# EAGLE design fp2ov2 (EAGLE 5.06)
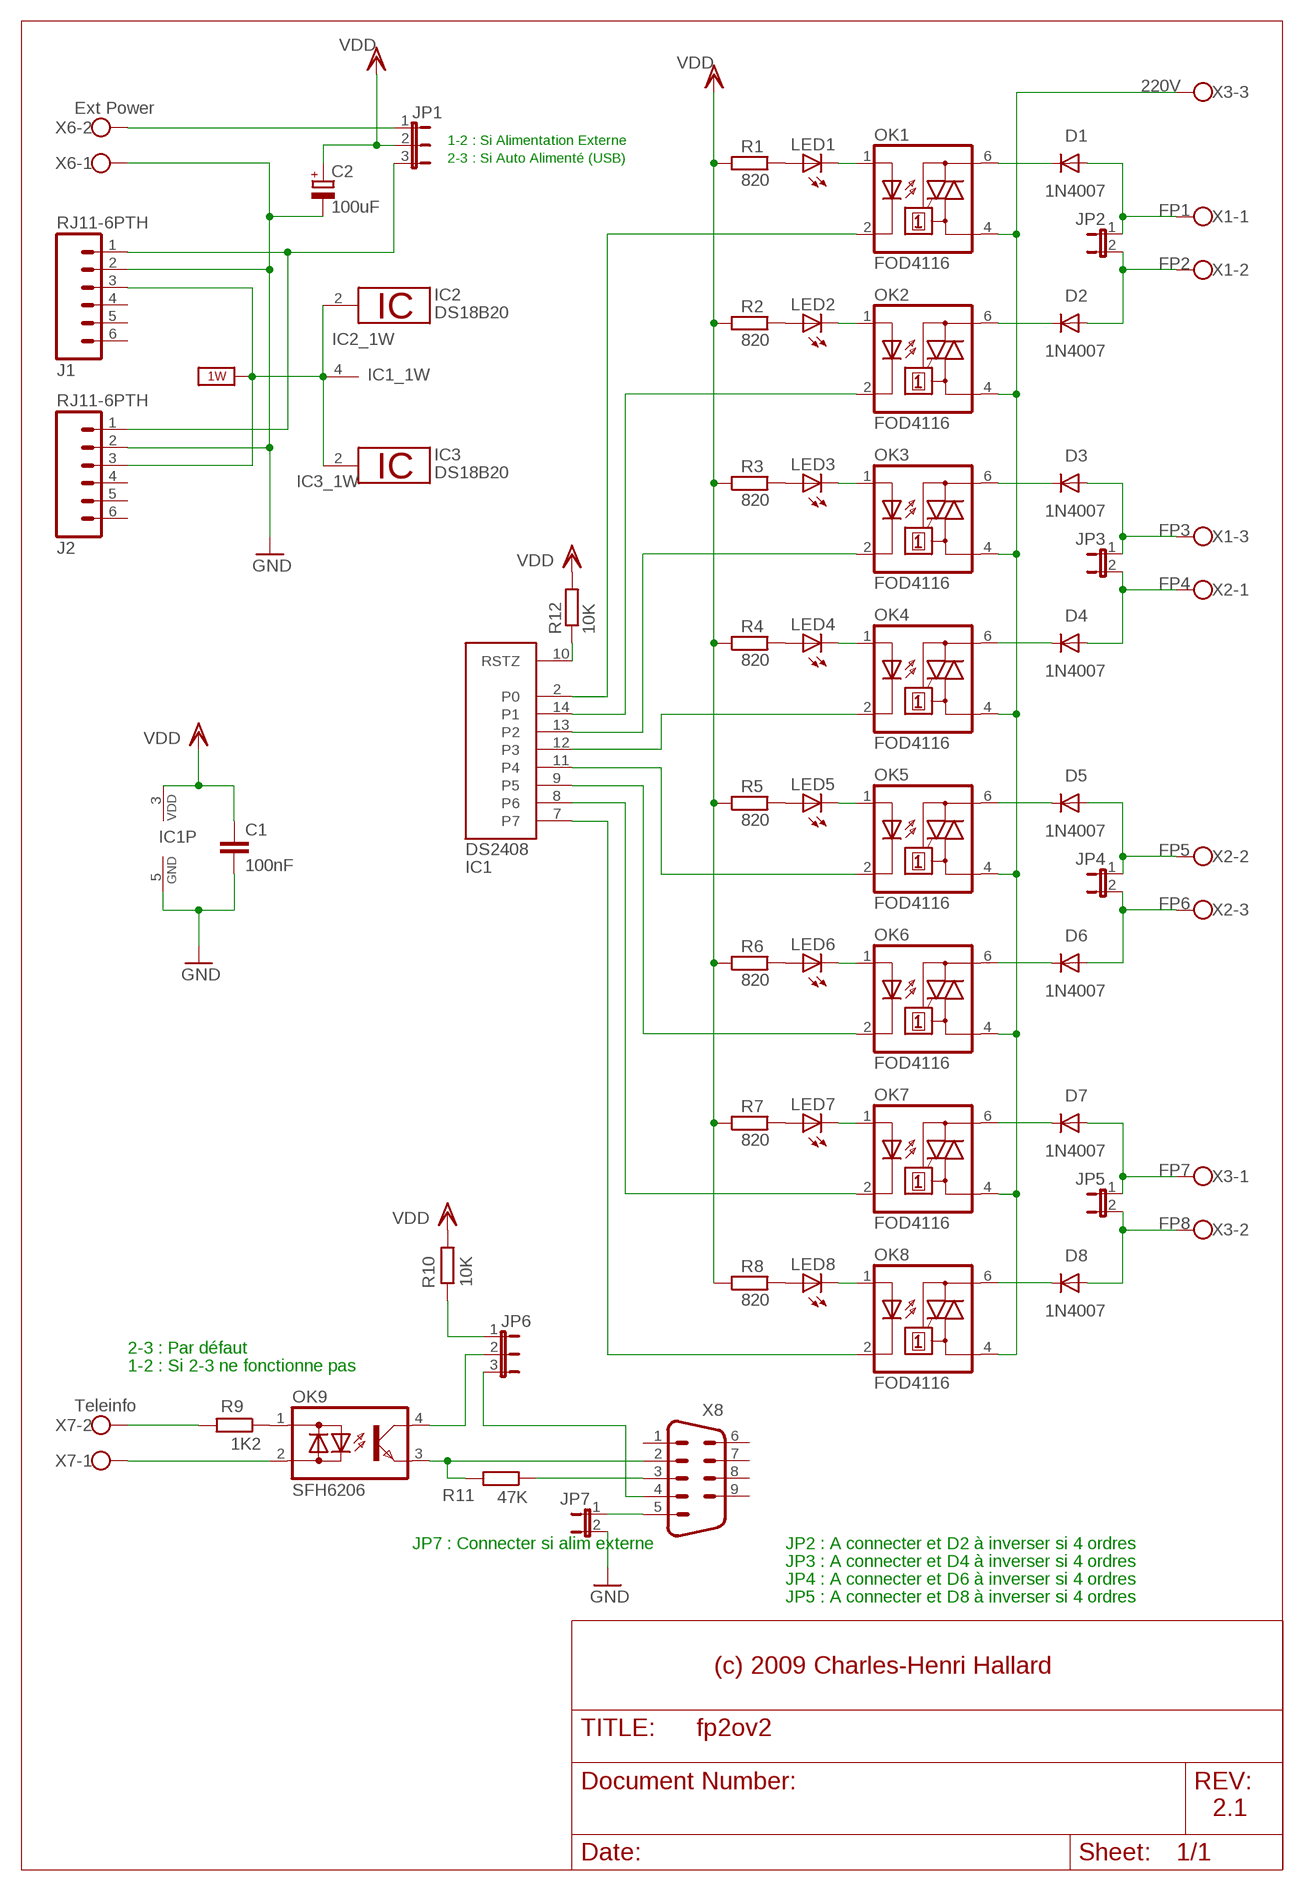
[diagram p0: schematic, sheet 1]

## Parts
C1  100nF  C-EU050-024X044  [C050-024X044]
C2  100uF  CPOL-EUE2,5-6E  [E2,5-6E]
D1  1N4007  1N4004  [DO41-10]
D2  1N4007  1N4004  [DO41-10]
D3  1N4007  1N4004  [DO41-10]
D4  1N4007  1N4004  [DO41-10]
D5  1N4007  1N4004  [DO41-10]
D6  1N4007  1N4004  [DO41-10]
D7  1N4007  1N4004  [DO41-10]
D8  1N4007  1N4004  [DO41-10]
IC1  DS2408  [SOIC-DIL16]
IC2  DS18B20  [TO92-]
IC3  DS18B20  [TO92-]
J1  RJ11-6PTH  [RJ11-6]
J2  RJ11-6PTH  [RJ11-6]
JP1  JP2E  [JP2]
JP2  JP1E  [JP1]
JP3  JP1E  [JP1]
JP4  JP1E  [JP1]
JP5  JP1E  [JP1]
JP6  JP2E  [JP2]
JP7  JP1E  [JP1]
LED1  LED3MM  [LED3MM]
LED2  LED3MM  [LED3MM]
LED3  LED3MM  [LED3MM]
LED4  LED3MM  [LED3MM]
LED5  LED3MM  [LED3MM]
LED6  LED3MM  [LED3MM]
LED7  LED3MM  [LED3MM]
LED8  LED3MM  [LED3MM]
OK1  FOD4116  [DIL06]
OK2  FOD4116  [DIL06]
OK3  FOD4116  [DIL06]
OK4  FOD4116  [DIL06]
OK5  FOD4116  [DIL06]
OK6  FOD4116  [DIL06]
OK7  FOD4116  [DIL06]
OK8  FOD4116  [DIL06]
OK9  SFH6206  SFH620A  [DIL04]
R1  820  R-EU_0207/10  [0207/10]
R2  820  R-EU_0207/10  [0207/10]
R3  820  R-EU_0207/10  [0207/10]
R4  820  R-EU_0207/10  [0207/10]
R5  820  R-EU_0207/10  [0207/10]
R6  820  R-EU_0207/10  [0207/10]
R7  820  R-EU_0207/10  [0207/10]
R8  820  R-EU_0207/10  [0207/10]
R9  1K2  R-EU_0207/10  [0207/10]
R10  10K  R-EU_0207/10  [0207/10]
R11  47K  R-EU_0207/10  [0207/10]
R12  10K  R-EU_0207/12  [0207/12]
X1  CON-CLAMP-3  [W237-103]
X2  CON-CLAMP-3  [W237-103]
X3  CON-CLAMP-3  [W237-103]
X6  Ext Power  W237-102  [W237-102]
X7  Teleinfo  W237-102  [W237-102]
X8  M09HP  [M09HP]

## Nets
1W: IC1.4(1W) IC2.2 IC3.2 J1.3 J2.3 ; supply symbol labelled 1W_SUP
220V [220]: OK1.4(A1) OK2.4(A1) OK3.4(A1) OK4.4(A1) OK5.4(A1) OK6.4(A1) OK7.4(A1) OK8.4(A1) X3.3
FP1 [220]: D1.A JP2.1 X1.1
FP2 [220]: D2.A JP2.2 X1.2
FP3 [220]: D3.A JP3.1 X1.3
FP4 [220]: D4.A JP3.2 X2.1
FP5 [220]: D5.A JP4.1 X2.2
FP6 [220]: D6.A JP4.2 X2.3
FP7 [220]: D7.A JP5.1 X3.1
FP8 [220]: D8.A JP5.2 X3.2
GND [Power]: C1.2 C2.- IC1.5(GND) J1.2 J2.2 JP7.2 X6.1
N$1: LED1.K(C) OK1.1(A)
N$2: LED2.K(C) OK2.1(A)
N$3: LED1.A R1.2
N$4: LED2.A R2.2
N$5: IC1.14(P1) OK2.2(C)
N$6: OK9.1(AC1) R9.1
N$7 [220]: D1.C OK1.6(A2)
N$8 [220]: D2.C OK2.6(A2)
N$9 [220]: D3.C OK3.6(A2)
N$10: OK9.2(AC2) X7.1
N$11: LED3.K(C) OK3.1(A)
N$12: IC1.13(P2) OK3.2(C)
N$13: LED4.K(C) OK4.1(A)
N$14: IC1.12(P3) OK4.2(C)
N$15: IC1.11(P4) OK5.2(C)
N$16: IC1.9(P5) OK6.2(C)
N$17: IC1.8(P6) OK7.2(C)
N$18 [220]: D4.C OK4.6(A2)
N$19: LED3.A R3.2
N$20 [220]: D6.C OK6.6(A2)
N$21: IC1.7 OK8.2(C)
N$22: LED4.A R4.2
N$23: LED5.K(C) OK5.1(A)
N$24: LED6.K(C) OK6.1(A)
N$25: LED6.A R6.2
N$26: LED7.A R7.2
N$27: LED8.A R8.2
N$28: LED5.A R5.2
N$29: IC1.2(P0) OK1.2(C)
N$30 [220]: D5.C OK5.6(A2)
N$31: JP6.1 R10.2
N$32: OK9.3(E) R11.2 X8.2
N$33: LED7.K(C) OK7.1(A)
N$34: LED8.K(C) OK8.1(A)
N$35: JP7.1 X8.5
N$36: JP6.2 OK9.4(C)
N$37: R9.2 X7.2
N$39 [220]: D8.C OK8.6(A2)
N$40 [220]: D7.C OK7.6(A2)
N$41: JP6.3 X8.4
N$42: R11.1 X8.3
N$74: IC1.10(RSTZ) R12.1
N$100 [Power]: J1.1 J2.1 JP1.3
N$101 [Power]: JP1.1 X6.2
VDD [Power]: C1.1 C2.+ IC1.3(VDD) JP1.2 R1.1 R2.1 R3.1 R4.1 R5.1 R6.1 R7.1 R8.1 R10.1 R12.2
Unconnected: J1.4 J1.5 J1.6 J2.4 J2.5 J2.6 X8.1 X8.6 X8.7 X8.8 X8.9

## Notes on the sheet
- 1-2 : Si Alimentation Externe
- 2-3 : Si Auto Alimenté (USB)
- 2-3 : Par défaut
- 1-2 : Si 2-3 ne fonctionne pas
- JP7 : Connecter si alim externe | JP2 : A connecter et D2 à inverser si 4 ordres
- JP3 : A connecter et D4 à inverser si 4 ordres
- JP4 : A connecter et D6 à inverser si 4 ordres
- JP5 : A connecter et D8 à inverser si 4 ordres
- (c) 2009 Charles-Henri Hallard
- 2.1

## Power pins joined to a net without a drawn wire
GND: IC2.1 IC3.1
VDD: IC2.3 IC3.3

## Library data of the parts
C1 = resistor:C-EU: CAPACITOR, European symbol
C2 = resistor:CPOL-EU: POLARIZED CAPACITOR, European symbol
D1-D8 = diode:1N4004: DIODE general purpose rectifier, 1 A
IC1 = _c2h:DS2408: 8-Channel Addressable Switch This is a general purpose I/O multiplier. The PIO pins P0..P7 are inputs/open drain outputs and can be used in a mixed I/O fashion. Output sink capability is appr. 4mA. Each input state can be read but changing input signals additionally trigger the egde detector for this input. The edge detector state can be read back, too. The RSTZ pin can be configured by software as a –STROBE output (default) or as the common edge detector –RESET input. In the latter mode, the output pins are all set to floating on a –RESET trigger, too. Author: Jan Kandziora <jjj@gmx.de>
IC2 IC3 = 1wire:DS18B20: Programmable Resolution Digital Thermometer This chip provides a onewire thermosensor with approx. 0.5°C accuracy. A programmable over/undertemperure alarm is available. The precision can be set from 9..12 bits. Notes: Vdd must be applied for accurate measurements at low temperatures, as the parasite power circuit otherwise heats the sensor. If parasite power is used, Vdd has to be connected to GND. The DS1822 is a low-cost thermometer chip, the DS18S20 is similar to the DS18B20, but with 9 Bit precision only. Author: Jan Kandziora <jjj@gmx.de>
J1 J2 = _c2h:RJ11-6: RJ11 Jack Simple 6 pin RJ11 jack. Commonly found on CAT3 devices and Microchip programmers. SKU: PRT-00132
JP1 JP6 = jumper:JP2E: JUMPER
JP2-JP5 JP7 = jumper:JP1E: JUMPER
LED1-LED8 = led:LED: LED OSRAM: - CHIPLED LG R971, LG N971, LY N971, LG Q971, LY Q971, LO R971, LY R971 LH N974, LH R974 LS Q976, LO Q976, LY Q976 LO Q996 - Hyper CHIPLED LW Q18S LB Q993, LB Q99A, LB R99A - SideLED LS A670, LO A670, LY A670, LG A670, LP A670 LB A673, LV A673, LT A673, LW A673 LH A674 LY A675 LS A676, LA A676, LO A676, LY A676, LW A676 LS A679, LY A679, LG A679 - Hyper Micro SIDELED® LS Y876, LA Y876, LO Y876, LY Y876 LT Y87S - SmartLED LW L88C, LW L88S LB L89C, LB L89S, LG L890 LS L89K, LO L89K, LY L89K LS L896, LA L896, LO L896, LY L896 - TOPLED LS T670, LO T670, LY T670, LG T670, LP T670 LSG T670, LSP T670, LSY T670, LOP T670, LYG T670 LG T671, LOG T671, LSG T671 LB T673, LV T673, LT T673, LW T673 LH T674 LS T676, LA T676, LO T676, LY T676, LB T676, LH T676, LSB T676, LW T676 LB T67C, LV T67C, LT T67C, LS T67K, LO T67K, LY T67K, LW E67C LS E67B, LA E67B, LO E67B, LY E67B, LB E67C, LV E67C, LT E67C LW T67C LS T679, LY T679, LG T679 LS T770, LO T770, LY T770, LG T770, LP T770 LB T773, LV T773, LT T773, LW T773 LH T774 LS E675, LA E675, LY E675, LS T675 LS T776, LA T776, LO T776, LY T776, LB T776 LHGB T686 LT T68C, LB T68C - Hyper Mini TOPLED® LB M676 - Mini TOPLED Santana® LG M470 LS M47K, LO M47K, LY M47K Source: http://www.osram.convergy.de LUXEON: - LUMILED® LXK2-PW12-R00, LXK2-PW12-S00, LXK2-PW14-U00, LXK2-PW14-V00 LXK2-PM12-R00, LXK2-PM12-S00, LXK2-PM14-U00 LXK2-PE12-Q00, LXK2-PE12-R00, LXK2-PE12-S00, LXK2-PE14-T00, LXK2-PE14-U00 LXK2-PB12-K00, LXK2-PB12-L00, LXK2-PB12-M00, LXK2-PB14-N00, LXK2-PB14-P00, LXK2-PB14-Q00 LXK2-PR12-L00, LXK2-PR12-M00, LXK2-PR14-Q00, LXK2-PR14-R00 LXK2-PD12-Q00, LXK2-PD12-R00, LXK2-PD12-S00 LXK2-PH12-R00, LXK2-PH12-S00 LXK2-PL12-P00, LXK2-PL12-Q00, LXK2-PL12-R00 Source: www.luxeon.com KINGBRIGHT: KA-3528ASYC Source: www.kingbright.com
OK1-OK8 = _c2h:FOD4116: SIEMENS OPTO COUPLER
OK9 = optocoupler:SFH620: Optocoupler, Phototransistor Output, AC Input Source: http://www.vishay.com/docs/83675/sfh620.pdf
R1-R12 = resistor:R-EU_: RESISTOR, European symbol
X1-X3 = _c2h:CON-CLAMP-3: WAGO SCREW CLAMP
X6 X7 = con-wago-500:W237-102: WAGO SCREW CLAMP
X8 = con-subd:M09: SUB-D

## Net classes
0 default: width 0.3 mm
1 220: width 1 mm, drill 0.203 mm
2 Power: width 0.3 mm

## Board
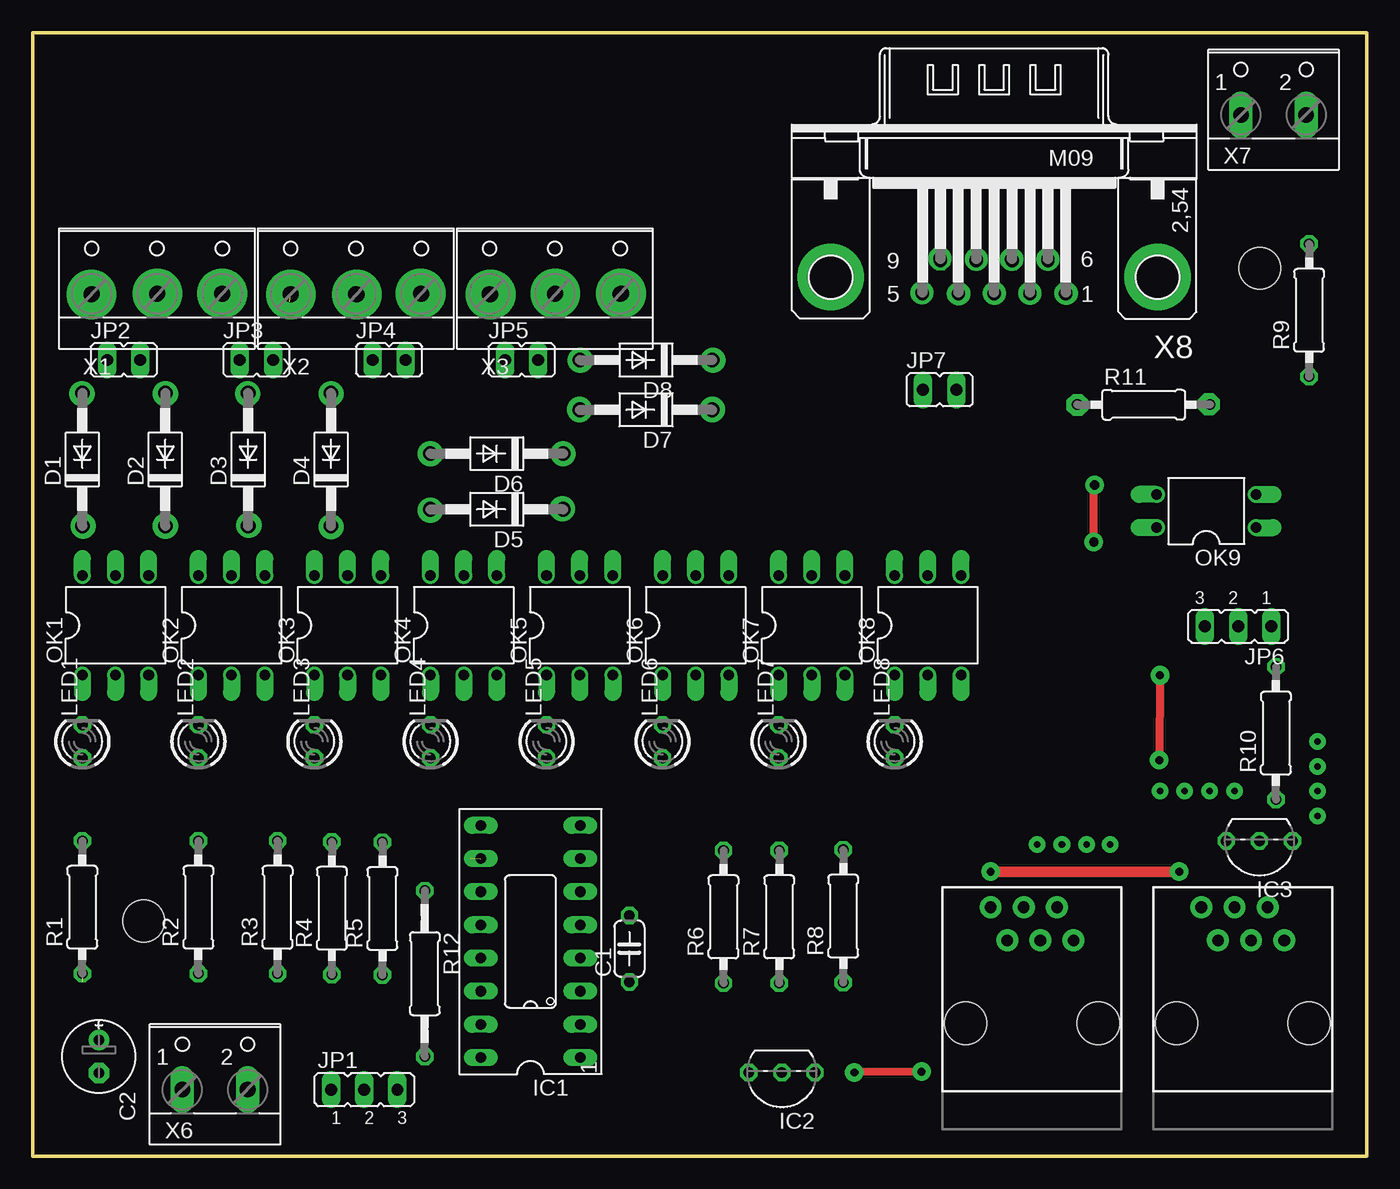
[diagram p1: board, top side]
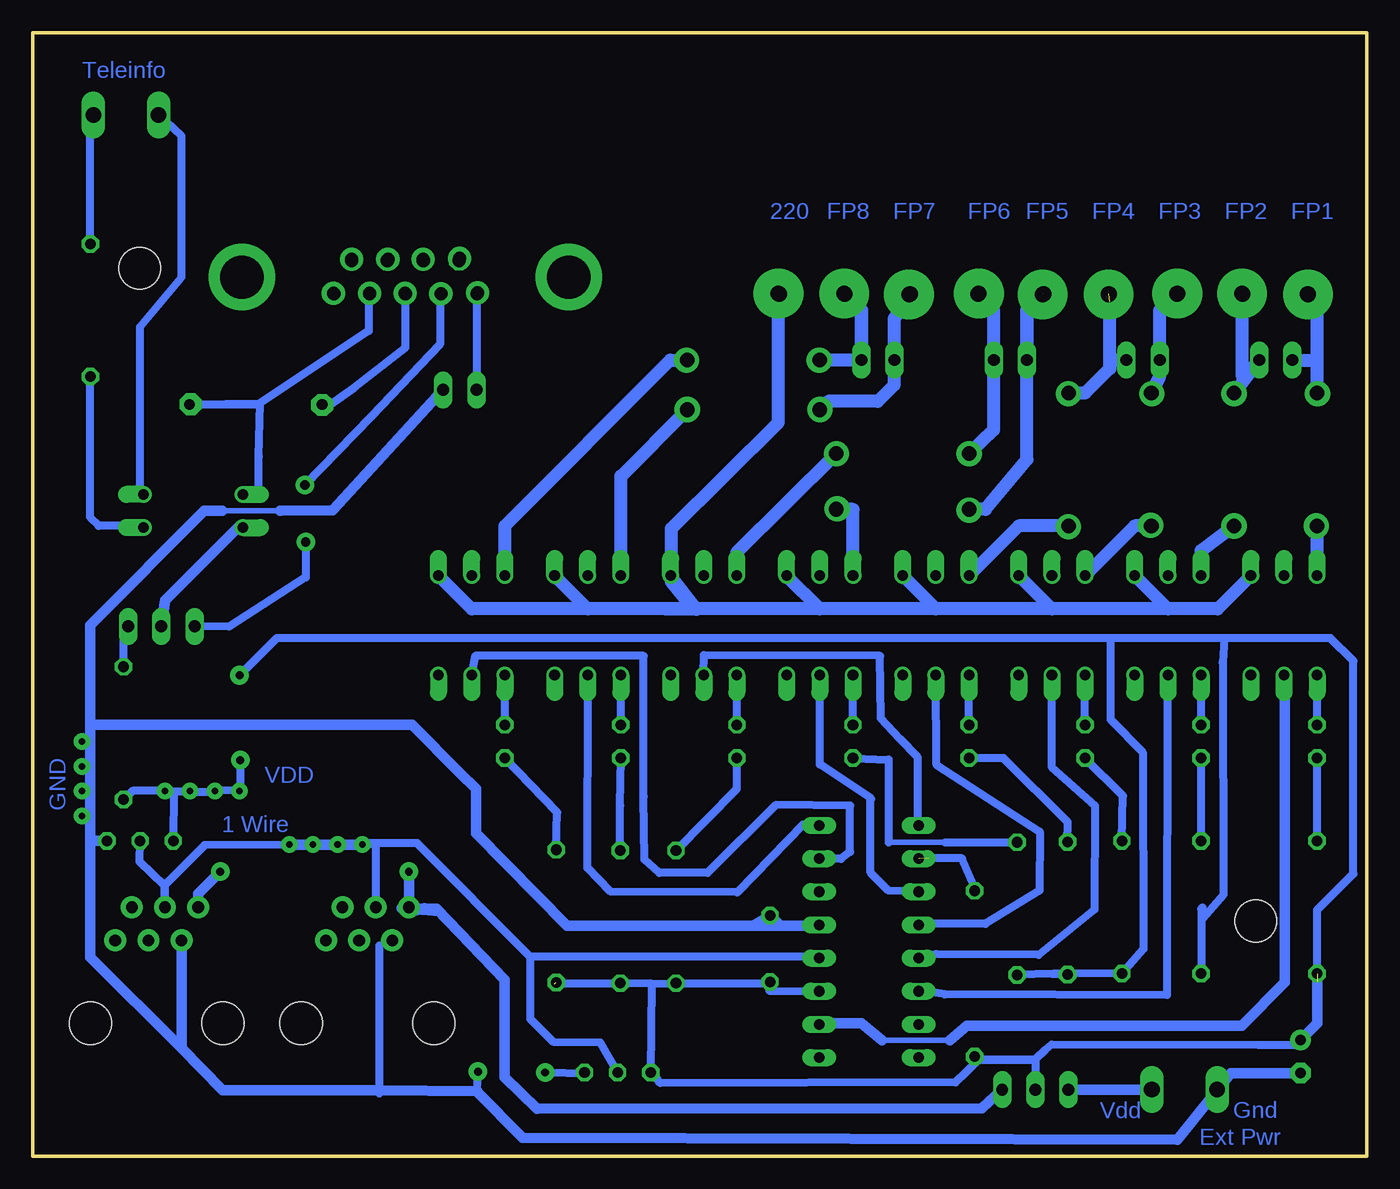
[diagram p2: board, bottom side, seen from below]

Size 102.22 x 86.03 mm. Coordinates in mm from the lower left corner, seen from the top.
Outline: 0,0 102.22,0 102.22,86.03 0,86.03 0,0
Copper layers (1*16): Top 0.035mm / dielectric 1.5mm / Bottom 0.035mm
Design rules "default": minimum track width 10mil, minimum drill 24mil, track to track 8mil, track to pad 8mil, pad to pad 8mil, via to via 8mil, smd to smd 8mil, copper to edge 40mil, drill to drill 8mil, minimum pad ring 10mil, minimum via ring 8mil, stop-mask expansion 4mil, vias tented up to drill 0mil, thermal gap 10mil
Holes 3.2 mm at 8.5,18 94,68

### Footprints (pad centres in the part's own frame; a part is rotated, then mirrored left to right if it is on the bottom)
C050-024X044 = drill 0.813 octagon: 1 -2.54,0; 2 2.54,0
E2,5-6E = drill 0.813 pad 1.575 round: + -1.27,0 | drill 0.813 pad 1.575 octagon: - 1.27,0
DO41-10 = drill 1.118 round: A 5.08,0; C -5.08,0
SOIC-DIL16 = drill 0.813 long: 1 -8.89,-3.81; 2 -6.35,-3.81; 3 -3.81,-3.81; 4 -1.27,-3.81; 5 1.27,-3.81; 6 3.81,-3.81; 7 6.35,-3.81; 8 8.89,-3.81; 9 8.89,3.81; 10 6.35,3.81; 11 3.81,3.81; 12 1.27,3.81; 13 -1.27,3.81; 14 -3.81,3.81; 15 -6.35,3.81; 16 -8.89,3.81
TO92- = drill 0.813 octagon: 1 -2.54,0; 2 0,0; 3 2.54,0
RJ11-6 = drill 0.889 pad 1.676 round: 1 1.905,8.89; 2 3.175,6.35; 3 4.445,8.89; 4 5.715,6.35; 5 6.985,8.89; 6 8.255,6.35 | hole 3.251: 0,0; 10.16,0
JP2 = drill 0.914 long: 1 -2.54,0; 2 0,0; 3 2.54,0
JP1 = drill 0.914 long: 1 0,-1.27; 2 0,1.27
LED3MM = drill 0.813 octagon: A -1.27,0; K 1.27,0
DIL06 = drill 0.813 offset: 1 -2.54,-3.81; 2 0,-3.81; 3 2.54,-3.81; 4 2.54,3.81; 5 0,3.81; 6 -2.54,3.81
DIL04 = drill 0.813 offset: 1 -1.27,-3.81; 2 1.27,-3.81; 3 1.27,3.81; 4 -1.27,3.81
0207/10 = drill 0.813 octagon: 1 -5.08,0; 2 5.08,0
0207/12 = drill 0.813 octagon: 1 -6.35,0; 2 6.35,0
W237-103 = drill 1.194 long: 1 -5,-1.29; 2 0,-1.29; 3 5,-1.29
W237-102 = drill 1.194 long: 1 -2.5,-1.27; 2 2.5,-1.27
M09HP = drill 1.016 octagon: 1 -5.486,1.27; 2 -2.743,1.27; 3 0,1.27; 4 2.743,1.27; 5 5.486,1.27; 6 -4.115,-1.27; 7 -1.372,-1.27; 8 1.372,-1.27; 9 4.115,-1.27 | drill 3.302 pad 5.08 round: G1 -12.522,0; G2 12.522,0

### Placement (x,y rotation side)
C1  45.72,15.88 90 top
C2  5.08,7.62 270 top
D1  3.81,53.34 90 top
D2  10.16,53.34 90 top
D3  16.51,53.34 90 top
D4  22.86,53.34 90 top
D5  35.56,49.53 180 top
D6  35.56,53.79 180 top
D7  46.99,57.15 180 top
D8  46.99,60.96 180 top
IC1  38.14,16.43 90 top
IC2  57.4,6.39 180 top
IC3  93.98,24.13 180 top
J1  87.63,10.16 0 top
J2  71.49,10.16 0 top
JP1  25.4,5.08 0 top
JP2  6.99,60.96 270 top
JP3  17.14,60.96 270 top
JP4  27.3,60.96 270 top
JP5  37.47,60.96 270 top
JP6  92.35,40.56 180 top
JP7  69.49,58.67 270 top
LED1  3.81,31.75 90 top
LED2  12.7,31.75 90 top
LED3  21.59,31.75 90 top
LED4  30.48,31.75 90 top
LED5  39.37,31.75 90 top
LED6  48.26,31.75 90 top
LED7  57.15,31.75 90 top
LED8  66.04,31.75 90 top
OK1  6.35,40.64 0 top
OK2  15.24,40.64 0 top
OK3  24.13,40.64 0 top
OK4  33.02,40.64 0 top
OK5  41.91,40.64 0 top
OK6  50.8,40.64 0 top
OK7  59.69,40.64 0 top
OK8  68.58,40.64 0 top
OK9  89.91,49.4 90 top
R1  3.81,19.05 90 top
R2  12.7,19.05 90 top
R3  18.76,19.05 90 top
R4  22.93,18.97 90 top
R5  26.8,18.95 90 top
R6  52.93,18.32 90 top
R7  57.2,18.32 90 top
R8  62.1,18.37 90 top
R9  97.79,64.77 90 top
R10  95.25,32.38 90 top
R11  85.11,57.54 0 top
R12  30.05,13.97 270 top
X1  9.53,67.31 0 top
X2  24.77,67.31 0 top
X3  40.01,67.31 0 top
X6  13.97,6.35 0 top
X7  95.06,81 0 top
X8  73.66,67.31 180 top

### Tracks (layer width: path | path; a pad name or v marks a point on that pad's centre or on a via)
1W
  Bottom 0.61: IC2.2 58.74,8.7 62.35,8.76 64.1,10.5 64.1,15.26 | IC1.4 41.95,15.27 64.1,15.26 | 64.1,15.26 72.74,23.96 76.85,23.96 76.95,24.07 76.95,23.91 82.7,23.8 | 82.7,23.8 75.92,23.93 75.92,19.12 J2.3 | IC3.2 94.02,22.54 92.11,20.68 92.11,19.15 J1.3 92.11,20.74 89.04,23.8 82.7,23.85 82.7,23.8
220V
  Bottom 1: OK1.4 11.43,41.91 15.24,41.91 | 15.24,41.91 OK2.4 | 24.13,41.91 OK3.4 | 15.24,41.91 24.13,41.91 | 33.02,41.91 OK4.4 | 24.13,41.91 33.02,41.91 | 41.91,41.91 OK5.4 | 33.02,41.91 41.91,41.91 | 53.43,41.91 51.36,41.85 OK6.4 | 41.91,41.91 53.43,41.91 | 59.69,41.91 OK7.4 | 53.43,41.91 53.76,41.91 | 53.76,41.91 59.69,41.91 | OK8.4 68.58,41.91 59.69,41.91 | 53.76,41.91 51.58,41.91 53.27,43.99 53.27,48.04 45.09,56.16 45.09,64.14 X3.3
FP1
  Bottom 1: D1.A 3.81,60.96 | 3.81,60.96 3.81,64.77 X1.1 | JP2.1 3.81,60.96
FP2
  Bottom 1: D2.A JP2.2 9.53,59.69 X1.2
FP3
  Bottom 1: D3.A 15.88,59.69 JP3.1 15.88,64.77 15.24,65.41 X1.3
FP4  (1 unrouted)
  Bottom 1: D4.A 21.59,58.42 19.68,60.33 19.68,60.96 19.68,65.41
  Bottom 1.016: 19.68,60.96 JP3.2
FP5  (1 unrouted)
  Bottom 1: D5.A 29.21,49.53 26.04,53.34 JP4.1
  Bottom 1.016: JP4.1 26.04,64.77 24.77,66.04
FP6
  Bottom 1: X2.3 28.57,64.77 JP4.2 28.57,55.62 D6.A
FP7
  Bottom 1: X3.1 34.92,66.04 36.2,64.14 JP5.1 36.2,59.05 37.47,57.78 41.27,57.78 D7.A
FP8
  Bottom 1: JP5.2 D8.A
  Bottom 1.016: JP5.2 38.73,64.77 39.37,65.41 X3.2
GND  (via drill 0.6 pad 1.42)
  Top 0.61: v68.09,6.46 v62.95,6.4
  Bottom 0.254: 75.64,16.13 J2.2 | 87.64,5.03 87.68,5.08 | 75.69,5.03 75.64,4.79
  Bottom 0.3: 10.42,6.32 X6.1
  Bottom 0.406: 87.69,49.42 83.24,49.42
  Bottom 0.61: 75.64,4.79 75.64,16.13 | 68.16,5.01 v68.09,6.46 | IC2.1 59.78,6.35 v62.95,6.4
  Bottom 0.813: C2.- 10.42,6.32 14.53,1.24 64.67,1.38 68.19,4.95 | 46.98,17.64 45.09,17.78 C1.2 46.98,17.64 | 46.98,17.64 41.82,17.62 IC1.5 | 87.68,5.08 90.81,8.26 | 90.81,8.26 J1.2 | 97.79,24.13 97.79,15.24 90.81,8.26 | 97.79,24.13 97.79,33.02 | 97.79,33.02 97.79,40.64 89.09,49.42 87.69,49.42 | JP7.2 79.25,49.44 83.24,49.42 | 68.19,4.95 68.16,5.01 | 46.98,17.64 61.28,17.64 68.26,24.73 68.26,28.12 69.46,29.33 73.15,33.02 97.79,33.02 | 97.79,24.13 IC3.1 | 75.75,5.03 87.64,5.03 | 75.75,5.03 75.69,5.03 | 68.19,4.95 75.75,5.03
N$1
  Bottom 0.61: LED1.K OK1.1
N$2
  Bottom 0.61: LED2.K OK2.1
N$3
  Bottom 0.61: R1.2 LED1.A
N$4
  Bottom 0.61: R2.2 LED2.A
N$5
  Bottom 0.3: 34.29,12.7 IC1.14
  Bottom 0.61: 34.29,12.7 32.33,12.37 15.3,12.32 OK2.2
N$6
  Bottom 0.3: OK9.1 94.61,48.26
  Bottom 0.61: 94.61,48.26 97.16,48.26 97.79,48.9 R9.1
N$7
  Bottom 1: OK1.6 D1.C
N$8
  Bottom 1: OK2.6 12.7,46.35 D2.C
N$9
  Bottom 1: OK3.6 17.78,48.26 D3.C
N$10
  Bottom 0.3: OK9.2 93.98,51.44
  Bottom 0.61: 93.98,51.44 93.98,63.5 90.81,67.31 90.81,78.11 X7.1
N$11
  Bottom 0.61: LED3.K OK3.1
N$12
  Bottom 0.61: OK3.2 24.13,29.74 20.82,26.8 20.84,18.89 25.14,15.4 32.98,15.46 IC1.13
N$13
  Bottom 0.61: LED4.K OK4.1
N$14
  Bottom 0.3: 34.29,17.78 IC1.12
  Bottom 0.61: OK4.2 32.97,29.96 25.05,24.84 25.07,20.32 29.21,17.78 34.29,17.78
N$15
  Bottom 0.61: OK5.2 41.91,29.99 37.97,27.35 38.03,27.35 38.03,21.7 36.65,20.32 IC1.11
N$16
  Bottom 0.3: IC1.9 34.29,25.4
  Bottom 0.406: 50.86,36.94 50.79,37.1
  Bottom 0.61: 34.29,25.4 34.7,25.37 | 50.79,37.1 50.85,36.84 OK6.2 | 50.86,36.94 50.81,38.35 37.3,38.3 37.25,33.54 35.77,31.95 34.4,30.53 34.4,25.44 34.35,25.5 IC1.9
N$17
  Bottom 0.3: IC1.8 43.18,25.4
  Bottom 0.61: 43.18,25.4 48.22,20.2 57.94,20.25 59.7,22.07 59.68,35.95 59.61,35.96 OK7.2
N$18
  Bottom 1: OK4.6 26.67,48.26 D4.C
N$19
  Bottom 0.61: R3.2 18.68,27.58 LED3.A
N$20
  Bottom 1: OK6.6 48.26,46.23 D6.C
N$21
  Bottom 0.61: IC1.7 40.27,22.75 39.59,23.29 39.59,26.83 45.25,26.89 50.51,21.69 54.21,21.69 55.35,22.71 55.41,27.52 55.41,38.3 68.31,38.3 68.59,36.93 OK8.2
N$22
  Bottom 0.61: R4.2 22.93,25.56 27.84,30.48 LED4.A
N$23
  Bottom 0.61: LED5.K OK5.1
N$24
  Bottom 0.61: LED6.K OK6.1
N$25
  Bottom 0.61: R6.2 48.26,28.12 LED6.A
N$26
  Bottom 0.61: R7.2 57.2,26.85 LED7.A
N$27
  Bottom 0.61: R8.2 62.02,26.32 LED8.A
N$28
  Bottom 0.406: 36.64,24.02 32.33,24.02
  Bottom 0.61: LED5.A 36.65,30.37 36.64,24.02 | 32.33,24.02 R5.2
N$29
  Bottom 0.3: 41.91,10.16 IC1.2
  Bottom 0.406: 31.94,8.87 37.14,8.87
  Bottom 0.813: 41.91,10.16 38.71,10.16 37.14,8.87 | 31.94,8.87 30.63,9.96 9.57,9.96 6.29,13.29 6.29,36.16 6.3,36.83 OK1.2
N$30
  Bottom 1: OK5.6 39.37,49.53 D5.C
N$31
  Bottom 0.61: R10.2 95.25,39.37 JP6.1
N$32
  Bottom 0.61: OK9.3 84.9,50.67 84.9,53.56 84.78,57.63 R11.2 85,57.51 76.47,63.19 76.47,66.04 X8.2
N$33
  Bottom 0.61: LED7.K OK7.1
N$34
  Bottom 0.61: LED8.K OK8.1
N$35
  Bottom 0.61: X8.5 68.22,66.04 JP7.1
N$36
  Bottom 0.3: 86.36,48.26 OK9.4
  Bottom 0.813: JP6.2 92.08,42.55 86.36,48.26
N$37
  Bottom 0.61: R9.2 97.79,78.74 X7.2
N$38  (via drill 0.5 pad 1.27)
  other vias: 98.42,29.84
N$39
  Bottom 1: OK8.6 66.04,48.26 53.38,60.95 53.38,60.96 D8.C
N$40
  Bottom 1: OK7.6 57.15,52.07 D7.C
N$41  (via drill 0.7 pad 1.42)
  Top 0.61: v81.36,51.38 81.29,51.38 v81.29,47.02
  Bottom 0.61: X8.4 70.97,66.04 70.97,62.22 76.24,56.65 v81.36,51.38 | v81.29,47.02 81.29,44.31 87.18,40.55 JP6.3
N$42
  Bottom 0.61: R11.1 79.41,57.54 77.6,58.83 73.66,61.91 X8.3
N$44  (via drill 0.5 pad 1.27)
  other vias: 98.42,31.75
N$45  (via drill 0.5 pad 1.27)
  other vias: 98.42,27.94
N$46  (via drill 0.5 pad 1.27)
  other vias: 98.42,26.04
N$47  (via drill 0.5 pad 1.27)
  other vias: 90.17,27.94
N$48  (via drill 0.5 pad 1.27)
  other vias: 88.27,27.94
N$49  (via drill 0.5 pad 1.27)
  other vias: 86.36,27.94
N$50  (via drill 0.5 pad 1.27)
  other vias: 92.08,27.94
N$51  (via drill 0.5 pad 1.27)
  other vias: 76.94,23.86
N$52  (via drill 0.5 pad 1.27)
  other vias: 78.85,23.87
N$53  (via drill 0.5 pad 1.27)
  other vias: 80.75,23.87
N$54  (via drill 0.5 pad 1.27)
  other vias: 82.55,23.87
N$55  (via drill 0.6 pad 1.68)
  other vias: 80.04,57.52
N$56  (via drill 0.6 pad 1.68)
  other vias: 90.12,57.57
N$57  (via drill 0.6 pad 1.93)
  other vias: 30.46,49.46
N$58  (via drill 0.6 pad 1.93)
  other vias: 30.46,53.78
N$59  (via drill 0.6 pad 1.93)
  other vias: 40.64,53.78
N$60  (via drill 0.6 pad 1.93)
  other vias: 40.58,49.57
N$61  (via drill 0.6 pad 1.93)
  other vias: 41.9,57.17
N$62  (via drill 0.6 pad 1.93)
  other vias: 41.95,60.95
N$63  (via drill 0.6 pad 1.93)
  other vias: 52.12,60.95
N$64  (via drill 0.6 pad 1.93)
  other vias: 52.07,57.17
N$65  (via drill 0.6 pad 1.93)
  other vias: 22.86,58.38
N$66  (via drill 0.6 pad 1.93)
  other vias: 22.86,48.2
N$67  (via drill 0.6 pad 1.93)
  other vias: 16.57,48.31
N$68  (via drill 0.6 pad 1.93)
  other vias: 16.46,58.38
N$69  (via drill 0.6 pad 1.93)
  other vias: 10.17,58.38
N$70  (via drill 0.6 pad 1.93)
  other vias: 10.17,48.26
N$71  (via drill 0.6 pad 1.93)
  other vias: 3.88,48.26
N$72  (via drill 0.6 pad 1.93)
  other vias: 3.77,58.38
N$73
  Bottom 0.813: 82.64,23.85 77.06,23.85
N$74  (1 unrouted)
  Bottom 0.406: R12.1 30.11,20.69
  Bottom 0.61: 30.11,20.69 31.01,22.8 33.57,22.8
N$75  (via drill 1.2 pad 3.81)
  other vias: 24.84,65.98
N$76  (via drill 1.2 pad 3.81)
  other vias: 29.73,66.05
N$77  (via drill 1.2 pad 3.81)
  other vias: 35.07,65.98
N$78  (via drill 1.2 pad 3.81)
  other vias: 40.04,66.05
N$79  (via drill 1.2 pad 3.81)
  other vias: 45.08,66.05
N$80  (via drill 1.2 pad 3.81)
  other vias: 19.79,65.98
N$81  (via drill 1.2 pad 3.81)
  other vias: 14.53,66.05
N$82  (via drill 1.2 pad 3.81)
  other vias: 9.56,66.05
N$83  (via drill 1.2 pad 3.81)
  other vias: 4.52,65.98
N$84  (via drill 1 pad 1.78)
  other vias: 68.12,66.11
N$85  (via drill 1 pad 1.78)
  other vias: 69.51,68.74
N$86  (via drill 1 pad 1.78)
  other vias: 72.29,68.67
N$87  (via drill 1 pad 1.78)
  other vias: 75,68.67
N$88  (via drill 1 pad 1.78)
  other vias: 77.78,68.67
N$89  (via drill 1 pad 1.78)
  other vias: 79.17,66.07
N$90  (via drill 1 pad 1.78)
  other vias: 76.39,66.07
N$91  (via drill 1 pad 1.78)
  other vias: 73.68,66.07
N$92  (via drill 1 pad 1.78)
  other vias: 70.94,66.04
N$100  (via drill 0.6 pad 1.42)
  Top 0.813: v73.4,21.78 v87.84,21.78
  Bottom 0.813: J1.1 89.53,20.08 v87.84,21.78 | v73.4,21.78 73.37,20.62 73.37,18.65 72.19,18.97 71.43,18.78 | J2.1 71.43,18.78 | 71.43,18.78 73.95,18.98 71.27,18.93 66.07,13.51 66.07,6.02 63.55,3.61 29.48,3.67 27.96,5.08 JP1.3
N$101
  Bottom 0.813: X6.2 JP1.1
VDD  (via drill 0.6 pad 1.42)  (2 unrouted)
  Top 0.61: v86.36,36.82 v86.31,30.31
  Bottom 0.406: 54.91,6.84 IC2.3 | R12.2 29.71,7.77 30.76,6.38
  Bottom 0.61: R1.1 3.81,18.84 1.04,21.61 1.04,37.92 2.79,39.67 10.94,39.67 | 10.94,39.67 19.64,39.67 | 19.64,39.67 83.52,39.67 v86.36,36.82 | v86.31,30.31 86.31,28.02 88.39,27.96 88.5,27.85 90.19,27.85 90.25,27.9 91.39,27.9 | 91.39,27.9 92.05,27.9 92.11,27.96 94.57,27.96 95.22,27.3 R10.1 | R2.1 12.7,18.92 12.58,19.04 12.58,18.21 10.99,20.02 11.05,37.81 10.94,39.67 | 24.07,13.95 R4.1 | 24.07,13.95 R5.1 | 18.76,14.01 R3.1 | 18.76,14.01 24.07,13.95 | 18.76,14.01 17.12,15.87 17.17,30.91 19.64,33.43 19.64,39.67 | IC1.3 45.73,12.64 45.73,12.7 | C1.1 45.78,13.24 45.73,12.7 | 45.73,12.7 45.78,12.69 45.72,13.24 R6.1 54.75,13.19 54.86,13.23 | JP1.2 25.38,7.39 29.75,7.39 | 29.75,7.39 30.76,6.38 31.51,5.63 54.15,5.58 54.91,6.84 | R7.1 62.24,13.19 54.86,13.23 | 54.86,13.23 54.75,13.13 IC2.3 | 91.39,27.9 IC3.3 | 29.75,7.39 25.41,7.41 24.62,8.15 24.16,8.53 8.31,8.5 5.14,8.5 C2.+
  Bottom 0.813: C2.+ 3.81,10.16 3.81,13.34

### Text on the board
Bottom: Teleinfo | FP1 | FP2 | FP3 | FP4 | FP5 | FP6 | FP7 | FP8 | 220 | GND | VDD | 1 Wire | Gnd | Vdd | Ext Pwr